# Altium schematic sheet Radio.SchDoc: Wacky Control Radio
size A3; Author: Josiah Craw; Address1: ECE Department; Address2: University of Canterbury; Address3: Christchurch 8041; Address4: New Zealand; Revision: 1
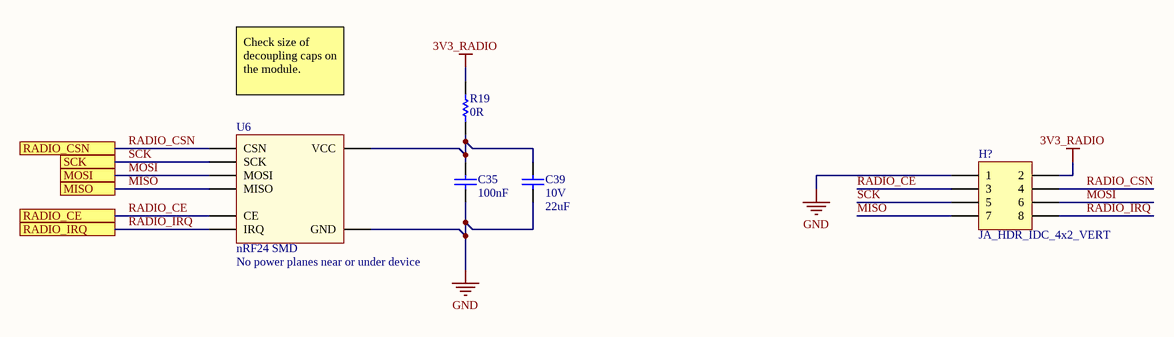
[diagram p0: Radio.SchDoc]

## Parts
C35  100nF  [CAPC1608L]
C39  Max Voltage: 10V  [CAPC3216L]  (hidden comment: 22uF)
H?  JA_HDR_IDC_4x2_VERT  [IDC2.54-V08D]
R19  0R  [RESC1608L]
U6  nRF24 SMD  Warning: No power planes near or under device  [NRF24]

## Ports
MISO, MOSI, RADIO_CE, RADIO_CSN, RADIO_IRQ, SCK

## Nets
3V3_RADIO: H?.2 R19.2
GND: C35.1 C39.1 H?.1 U6.2(GND)
MISO: H?.7 U6.7(MISO) ; port MISO
MOSI: H?.6 U6.6(MOSI) ; port MOSI
RADIO_CE: H?.3 U6.3(CE) ; port RADIO_CE
RADIO_CSN: H?.4 U6.4(CSN) ; port RADIO_CSN
RADIO_IRQ: H?.8 U6.8(IRQ) ; port RADIO_IRQ
SCK: H?.5 U6.5(SCK) ; port SCK
NetC35_2: C35.2 C39.2 R19.1 U6.1(VCC)

## Notes on the sheet
- Check size of decoupling caps on the module.
- Title
- Drawn by:
- Date:
- Time:
- Revision:
- Sheet
- of
- File:

## Library data of the parts
C35 = CC_100nF_0603: CAP CER 100nF X7R +-10% 50V 0603; PackageReference: 0603; Code_IPC: 1608 [0603]; Verify: *; Supplier: ECE Dept; Storage Location: PCB Assembly WS; Value: 100nF
C39 = CC_22uF_1206: CAP CER 22uF Y5V -20% +80% 10V 1206; Verify: *; Supplier: ECE Dept; Storage Location: PCB Assembly WS; Dielectric: Y5V; Footprint: 1206 (3216 metric); Value: 22uF
H? = JA_HDR_IDC_4x2_VERT: IDC Header, 2.54mm, 8-Pin, Vert; Manufacturer: Amphenol FCI; Manufacturer Part Number: 75869-132LF; Number of Positions: 8; Max Voltage Rating (AC): 500V; Connector Type: Male Pin; Gender: Male; Current Rating: 3A; Row Spacing: 0.1inch; Mating Post Length: 6mm; Supplier 1: Digi-Key; Stock 1: 8776; Pricing 1: 1=0.76, 10=0.668, 100=0.5766, 500=0.47178, 1000=0.41936, 5000=0.36694, 10000=0.34859 (USD); Mount: Through Hole; Contact Material: Bronze; Contact Plating: Gold,GXT; Colour: Blue; Housing Colour: Blue; Housing Material: Thermoplastic; Min Operating Temperature: -65°C; Max Operating Temperature: 125°C; Number of Rows: 2; Packaging: Rail/Tube; Package Quantity: 100; Termination: Solder; Number of Contacts: 8; Orientation: Straight; Voltage Rating: 500V; Length: 17.37mm; Pitch: 2.54mm; Depth: 9.55mm; Termination Post Length: 3.05mm; Contact Mating Length: 0.236inch; Radiation Hardening: No; Lead Free: Lead Free; REACH SVHC: No SVHC; ComponentLink1URL: http://uk.rs-online.com/webdocs/13ec/0900766b813ecbbf.pdf; ComponentLink1Description: http://uk.rs-online.com/webdocs/13ec/0900766b813ecbbf.pdf; ComponentLink2URL: https://cdn.amphenol-icc.com/media/wysiwyg/files/drawing/75869.pdf; ComponentLink2Description: https://cdn.amphenol-icc.com/media/wysiwyg/files/drawing/75869.pdf; ComponentLink3URL: http://portal.fciconnect.com/Comergent/fci/drawing/75869.pdf; ComponentLink3Description: http://portal.fciconnect.com/Comergent/fci/drawing/75869.pdf; ComponentLink4URL: http://portal.fciconnect.com/Comergent//fci/drawing/75869.pdf; ComponentLink4Description: http://portal.fciconnect.com/Comergent//fci/drawing/75869.pdf; Supplier Part Number 1: 609-3530-ND
R19 = RS_0R0: RES 0.0 OHM 1/10W 5% 0603 SMD; Storage Location: PCB Assembly WS; Supplier: ECE Dept; Value: 0R
U6 = NRF24: nRF24 SMD Module